# EAGLE design MakePython Audio v2.0 (EAGLE 6.1)
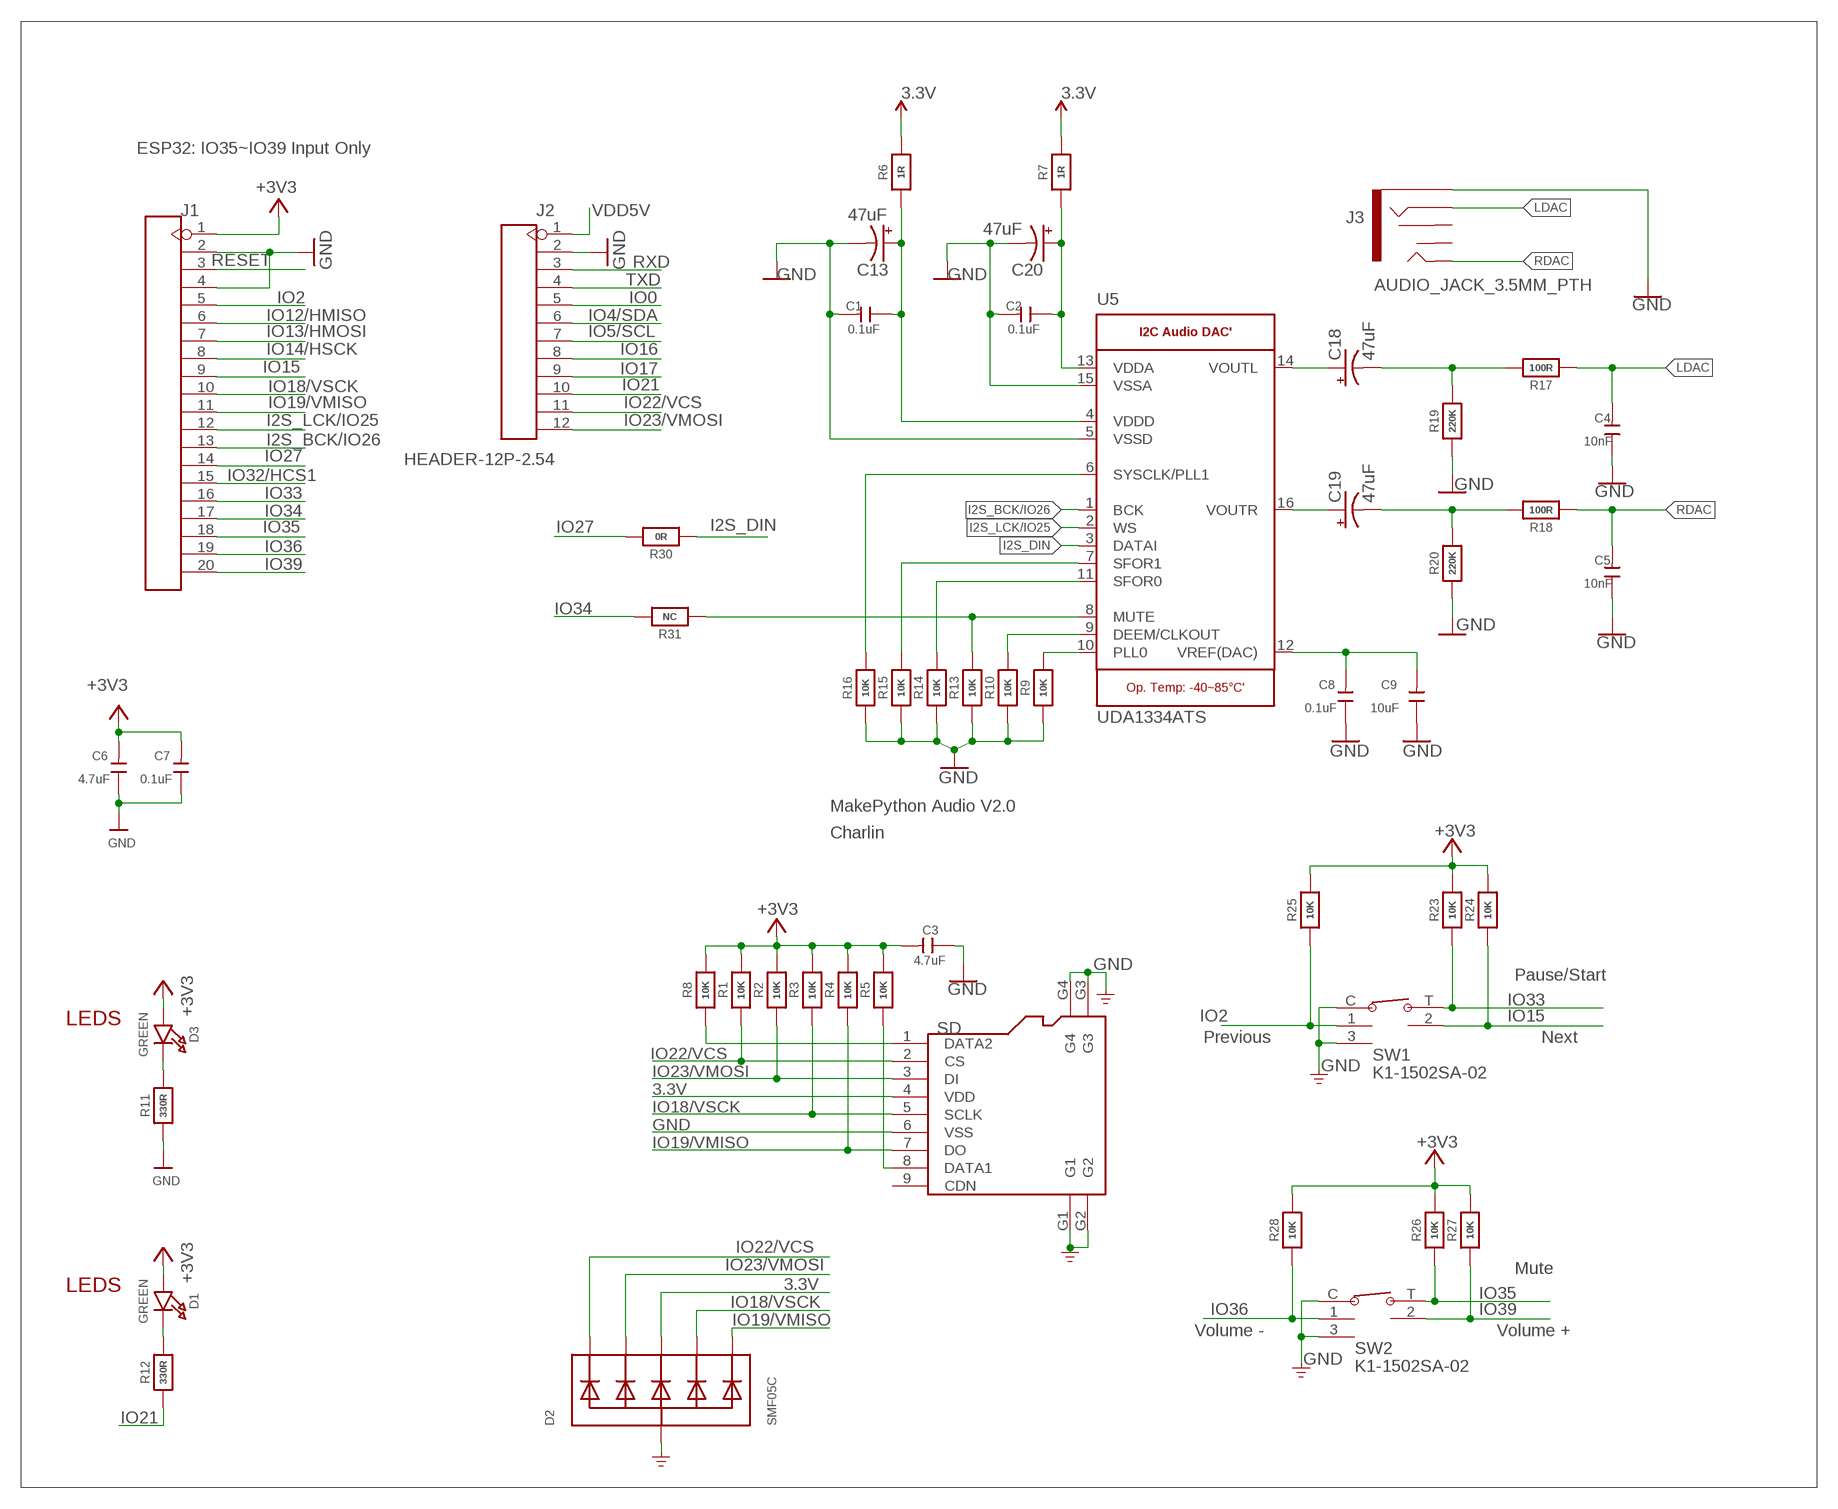
[diagram p0: schematic, sheet 1]

## Parts
C1  0.1uF  DISCRETE_C-0603  [DISCRETE_C0603]
C2  0.1uF  DISCRETE_C-0603  [DISCRETE_C0603]
C3  4.7uF  DISCRETE_C-0603  [DISCRETE_C0603]
C4  10nF  DISCRETE_C-0603  [DISCRETE_C0603]
C5  10nF  DISCRETE_C-0603  [DISCRETE_C0603]
C6  4.7uF  DISCRETE_C-0603  [DISCRETE_C0603]
C7  0.1uF  DISCRETE_C-0603  [DISCRETE_C0603]
C8  0.1uF  DISCRETE_C-0603  [DISCRETE_C0603]
C9  10uF  DISCRETE_C-0603  [DISCRETE_C0603]
C13  47uF  47UF-POLAR-EIA3528-10V-10%  [EIA3528]
C18  47uF  47UF-POLAR-EIA3528-10V-10%  [EIA3528]
C19  47uF  47UF-POLAR-EIA3528-10V-10%  [EIA3528]
C20  47uF  47UF-POLAR-EIA3528-10V-10%  [EIA3528]
D1  GREEN  LED0805_NOOUTLINE  [CHIPLED_0805_NOOUTLINE]
D2  SMF05C  TVSARRAY_5LANE  [SOT363]
D3  GREEN  LED0805_NOOUTLINE  [CHIPLED_0805_NOOUTLINE]
J1  HEADER-20P-2.54  [20P-2.54]
J2  HEADER-12P-2.54  [12P-2.54]
J3  AUDIO_JACK_3.5MM_PTH  [AUDIO-JACK]
R1  10K  RESISTOR_0603_NOOUT  [0603-NO]
R2  10K  RESISTOR_0603_NOOUT  [0603-NO]
R3  10K  RESISTOR_0603_NOOUT  [0603-NO]
R4  10K  RESISTOR_0603_NOOUT  [0603-NO]
R5  10K  RESISTOR_0603_NOOUT  [0603-NO]
R6  1R  RESISTOR_0603_NOOUT  [0603-NO]
R7  1R  RESISTOR_0603_NOOUT  [0603-NO]
R8  10K  RESISTOR_0603_NOOUT  [0603-NO]
R9  10K  RESISTOR_0603_NOOUT  [0603-NO]
R10  10K  RESISTOR_0603_NOOUT  [0603-NO]
R11  330R  RESISTOR_0603_NOOUT  [0603-NO]
R12  330R  RESISTOR_0603_NOOUT  [0603-NO]
R13  10K  RESISTOR_0603_NOOUT  [0603-NO]
R14  10K  RESISTOR_0603_NOOUT  [0603-NO]
R15  10K  RESISTOR_0603_NOOUT  [0603-NO]
R16  10K  RESISTOR_0603_NOOUT  [0603-NO]
R17  100R  RESISTOR_0603_NOOUT  [0603-NO]
R18  100R  RESISTOR_0603_NOOUT  [0603-NO]
R19  220K  RESISTOR_0603_NOOUT  [0603-NO]
R20  220K  RESISTOR_0603_NOOUT  [0603-NO]
R23  10K  RESISTOR_0603_NOOUT  [0603-NO]
R24  10K  RESISTOR_0603_NOOUT  [0603-NO]
R25  10K  RESISTOR_0603_NOOUT  [0603-NO]
R26  10K  RESISTOR_0603_NOOUT  [0603-NO]
R27  10K  RESISTOR_0603_NOOUT  [0603-NO]
R28  10K  RESISTOR_0603_NOOUT  [0603-NO]
R30  0R  RESISTOR_0603_NOOUT  [0603-NO]
R31  NC  RESISTOR_0603_NOOUT  [0603-NO]
SD  HOLDER-MICROSD-9P  [9P-SMD-W/-RING]
SW1  K1-1502SA-02  [SMD5-60P-1180L1170W]
SW2  K1-1502SA-02  [SMD5-60P-1180L1170W]
U5  UDA1334ATS  MICROBUILDER_AUDIO_I2S_UDA1334""  [MICROBUILDER_SSOP16_4.4MM]

## Nets
3.3V: C3.2 C6.2 C7.2 D1.A D2.4(C3) D3.A J1.1 R1.2 R2.2 R3.2 R4.2 R5.2 R6.2 R7.2 R8.2 R23.2 R24.2 R25.2 R26.2 R27.2 R28.2 SD.4(VDD) ; supply symbol labelled +3V3
GND: C1.2 C2.2 C3.1 C4.1 C5.1 C6.1 C7.1 C8.1 C9.1 C13.C(-) C20.C(-) D2.2(A) J1.2 J1.4 J2.2 J3.SLEEVE R9.1 R10.1 R11.1 R13.1 R14.1 R15.1 R16.1 R19.1 R20.1 SD.6(VSS) SD.G1 SD.G2 SD.G3 SD.G4 SW1.3 SW1.C SW2.3 SW2.C U5.5(VSSD) U5.15(VSSA)
I2S_BCK/IO26: J1.13 U5.1(BCK)
I2S_DIN: R30.1 U5.3(DATAI)
I2S_LCK/IO25: J1.12 U5.2(WS)
IO0: J2.5
IO2: J1.5 R25.1 SW1.1
IO4/SDA: J2.6
IO5/SCL: J2.7
IO12/HMISO: J1.6
IO13/HMOSI: J1.7
IO14/HSCK: J1.8
IO15: J1.9 R24.1 SW1.2
IO16: J2.8
IO17: J2.9
IO18/VSCK: D2.5(C4) J1.10 R3.1 SD.5(SCLK)
IO19/VMISO: D2.6(C5) J1.11 R4.1 SD.7(DO)
IO21: J2.10 R12.1
IO22/VCS: D2.1(C1) J2.11 R1.1 SD.2(CS)
IO23/VMOSI: D2.3(C2) J2.12 R2.1 SD.3(DI)
IO27: J1.14 R30.2
IO32/HCS1: J1.15
IO33: J1.16 R23.1 SW1.T
IO34: J1.17 R31.2
IO35: J1.18 R26.1 SW2.T
IO36: J1.19 R28.1 SW2.1
IO39: J1.20 R27.1 SW2.2
LDAC: C4.2 J3.RING R17.1
N$1: R8.1 SD.1(DATA2)
N$2: R5.1 SD.8(DATA1)
N$3: D1.C R12.2
N$5: D3.C R11.2
N$8: C18.A(+) U5.14(VOUTL)
N$11: C19.A(+) U5.16(VOUTR)
N$21: C18.C(-) R17.2 R19.2
N$23: C19.C(-) R18.2 R20.2
N$24: C2.1 C20.A(+) R7.1 U5.13(VDDA)
N$25: C1.1 C13.A(+) R6.1 U5.4(VDDD)
N$26: R16.2 U5.6(SYSCLK/PLL1)
N$27: R15.2 U5.7(SFOR1)
N$28: R14.2 U5.11(SFOR0)
N$29: R13.2 R31.1 U5.8(MUTE)
N$31: R10.2 U5.9(DEEM/CLKOUT)
N$32: R9.2 U5.10(PLL0)
N$33: C8.2 C9.2 U5.12(VREF(DAC))
RDAC: C5.2 J3.TIP R18.1
RESET: J1.3
RXD: J2.3
TXD: J2.4
VDD5V: J2.1
Unconnected: J3.RSH J3.TSH SD.9(CDN)

## Notes on the sheet
- ESP32: IO35~IO39 Input Only
- MakePython Audio V2.0
- Charlin
- Pause/Start
- LEDS
- Previous | Next
- Mute
- LEDS
- Volume - | Volume +

## Library data of the parts
C1-C9 = A9G:DISCRETE_C*: Ceramic Capacitors
C13 C18-C20 = SparkFun-Capacitors:47UF-POLAR: 47µF polarized capacitors A capacitor is a passive two-terminal electrical component used to store electrical energy temporarily in an electric field.; PROD_ID: CAP-08310
D1 D3 = microbuilder:LED: LED 0603 - 0603 Surface Mount Package 2mA: Green LED - Low Power (3.9mcd, 2ma, 1.7Vf) - Digikey: 475-2709-2-ND Orange LED - Low Power (9.8mcd, 2ma, 1.8Vf) - Digikey: 475-1194-2-ND Red LED - Low Power (5mcd, 2ma, 1.8Vf) - Digikey: 475-1195-2-ND Yellow LED - Low Power (7mcd, 2ma, 1.8Vf) - Digikey: 475-1196-2-ND 5mA: Blue LED - Low Power (17mcd, 5ma, 2.9Vf) - Digikey: LNJ937W8CRACT-ND 0805 - 0805 Surface Mount Package 2mA: Red LED (8.8mcd, 2mA, 1.8Vf, Clear) - Low Power [Digikey: 475-2510-1-ND] Green LED (5mcd, 2mA, 1.8Vf, Clear) - Low Power [Digikey: 475-2730-1-ND] Yellow LED (11.3mcd, 2mA, 1.8Vf, Clear) - Low Power [Digikey: 475-2555-1-ND] 20mA: Red LED (104mcd, 20mA, Diffused) - LS R976 [Digikey: 475-1278-6-ND] Red LED (12mcd, 20mA, 2.0Vf, Clear) - APT2012EC [Digikey: 754-1128-1-ND] Green LED (15mcd, 20mA, 2.2Vf, Clear) - APT2012GC [Digikey: 754-1131-1-ND] Orange LED (160mcd, 20mA, 2.1Vf, Clear) - APT2012SECK [Digikey: 754-1130-1-ND] 1206 - 1206 Surface Mount Package Green LED (26mcd, 20mA, Diffused) - LG N971 [Digikey: 475-1407-6-ND] Red LED (15mcd, 20mA, Diffused) - LH N974 [Digikey: 475-1416-6-ND] Cree - Cree High-Power Surface Mount LEDs XPEBWT-L1-0000-00D50 - White 111lm 350mA 2.9Vf 6200K 110° XTEAWT-00-0000-00000LEE3 - White 114lm 350mA 2.85Vf 5000K 115° Everlight - Everlight 45-21 Series Surface Mount LEDs 45-21/QK2C-B2832AC2CB2/2T - Warm White 2000mcd 20mA 3.25Vf 3050K 120° 45-21/LK2C-B38452C4CB2/2T - Nuetral White 2000mcd 20mA 3.25Vf 4150K 120° 45-21/LK2C-B50634C6CB2/2T - Cold White 2200mcd 20mA 3.25Vf 5650K 120° PLCC2 Reverse Mount LS T77K-J1L2-1-0-2-R18-Z - Red 11.25mcd 2mA 1.8Vf 630nm 120° LO T77K-L1M2-24-Z - Orange 19.6mcd 2mA 1.8Vf 606nm 120° LY T77K-K2M1-26-Z - Yellow 15.7mcd 2mA 1.8Vf 587nm 120°
D2 = microbuilder:TVSARRAY_5LANE: Voltage Transient Suppressor Array SOT363 SMF05C - 100W 5V: Digikey - SMF05CT1GOSCT-ND
J1 = Connector:HEADER-20P
J2 = Connector:HEADER-12P
J3 = SparkFun-Connectors:AUDIO_JACK_3.5MM: Audio Jack 3.5mm variants of PTH and SMT stereo audio jack with bypass switches. SparkFun Products: SparkFun SparkPunk Sound Kit <[https://www.sparkfun.com/products/11177]> - PTH MP3 Trigger <https://www.sparkfun.com/products/13720> -3.5mm SMD SparkFun PicoBoard <https://www.sparkfun.com/products/11888>- 2.5mm SMD; PROD_ID: CONN-08774; SF_ID: PRT-08032
R1-R20 R23-R28 R30 R31 = microbuilder:RESISTOR: Resistors For new designs, use the packages preceded by an '_' character since they are more reliable: The following footprints should be used on most boards: _0402 - Standard footprint for regular board layouts _0603 - Standard footprint for regular board layouts _0805 - Standard footprint for regular board layouts _1206 - Standard footprint for regular board layouts For extremely tight-pitch boards where space is at a premium, the following 'micro-pitch' footprints can be used (smaller pads, no silkscreen outline, etc.): _0402MP - Micro-pitch footprint for very dense/compact boards _0603MP - Micro-pitch footprint for very dense/compact boards _0805MP - Micro-pitch footprint for very dense/compact boards _1206MP - Micro-pitch footprint for very dense/compact boards
SD = Connector:HOLDER-MICROSD-9P
SW1 SW2 = self:K1-1502SA-02
U5 = Adafruit UDA1334 I2S DAC:MICROBUILDER_AUDIO_I2S_UDA1334: UDA1334 I2C Audio DAC Power Supply: 2.4-3.6V Sample frequencies from 16-100kHz

## Net classes
0 default: width 0.203 mm, drill 0.305 mm, clearance 0.152 mm
2 gnd: width 0.305 mm, drill 0.559 mm, clearance 0.254 mm
3 usbvcc: width 0.508 mm, drill 0.61 mm, clearance 0.254 mm

## Board
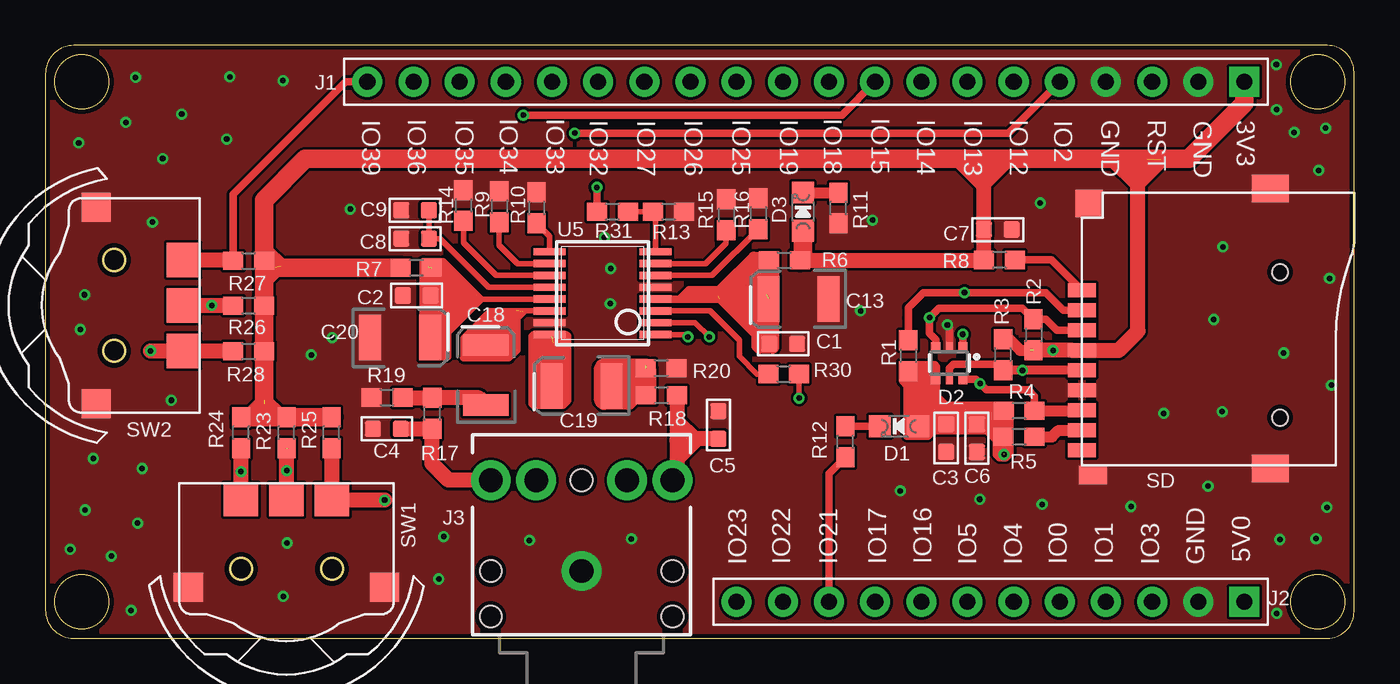
[diagram p1: board, top side]
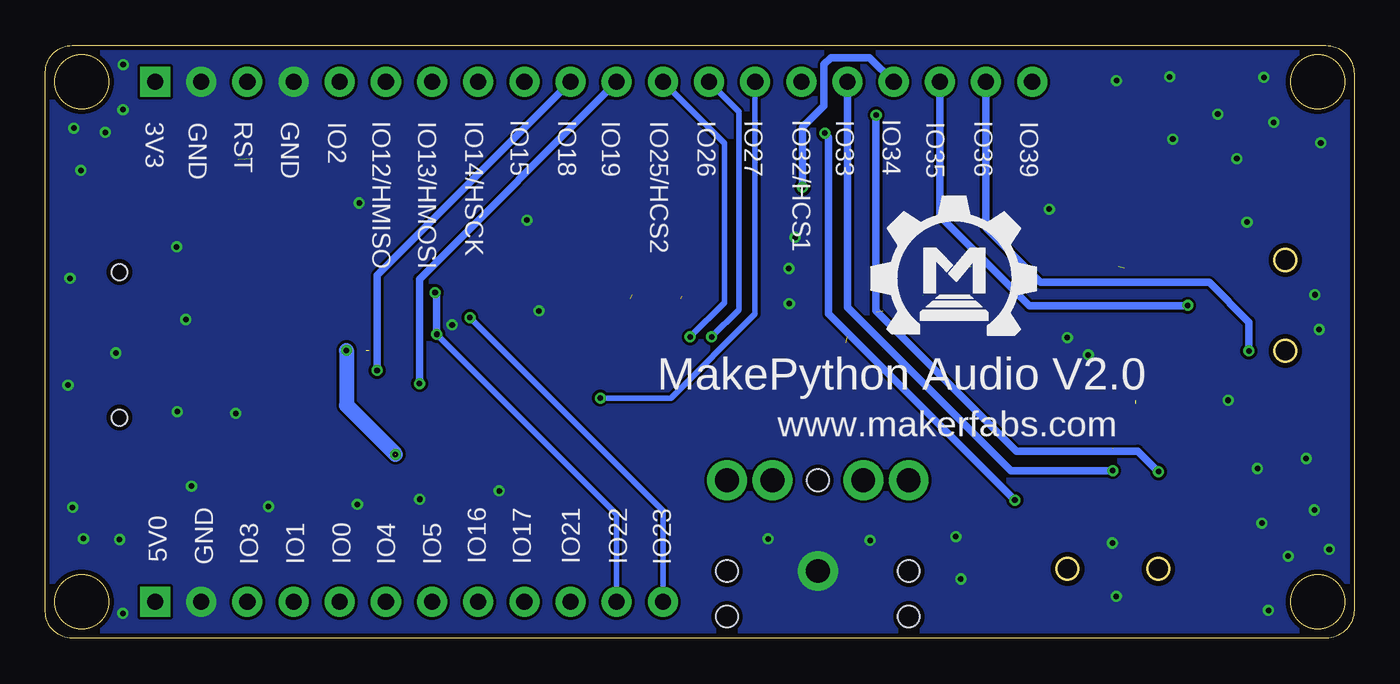
[diagram p2: board, bottom side, seen from below]

Size 72 x 32.6 mm. Coordinates in mm from the lower left corner, seen from the top.
Outline: 1.55,0 70.53,0 arc90 72,1.47 72,31.12 arc90 70.52,32.6 1.55,32.6 arc90 0,31.05 0,1.55 arc90 1.55,0
Outline: circle at 70,2 radius 1.5
Outline: circle at 70,30.6 radius 1.5
Outline: circle at 2,2 radius 1.5
Outline: circle at 2,30.6 radius 1.5
Copper layers (1*16): Top 0.035mm / dielectric 1.5mm / Bottom 0.035mm
Design rules: minimum track width 6mil, minimum drill 12mil, track to track 6mil, track to pad 6mil, pad to pad 6mil, via to via 6mil, smd to smd 0mil, copper to edge 10mil, drill to drill 10mil, minimum pad ring 10mil, minimum via ring 6mil, stop-mask expansion 2mil, vias tented up to drill 100mil, thermal gap 0mil

### Footprints (pad centres in the part's own frame; a part is rotated, then mirrored left to right if it is on the bottom)
DISCRETE_C0603 = smd 0.889 x 0.889: 1 -0.762,0; 2 0.762,0
EIA3528 = smd 1.2 x 2.5: A 1.65,0; C -1.65,0
CHIPLED_0805_NOOUTLINE = smd 1.2 x 1.2: A 0,-1.05; C 0,1.05
SOT363 = smd 0.5 x 0.5: 1 -0.75,-0.9; 3 0.75,-0.9; 4 0.75,0.9; 6 -0.75,0.9 | smd 0.4 x 0.5: 2 0,-0.9; 5 0,0.9
20P-2.54 = drill 0.889 pad 1.651 square: 1 -25.4,0 | drill 0.889 pad 1.651: 2 -22.86,0; 3 -20.32,0; 4 -17.78,0; 5 -15.24,0; 6 -12.7,0; 7 -10.16,0; 8 -7.62,0; 9 -5.08,0; 10 -2.54,0; 11 0,0; 12 2.54,0; 13 5.08,0; 14 7.62,0; 15 10.16,0; 16 12.7,0; 17 15.24,0; 18 17.78,0; 19 20.32,0; 20 22.86,0
12P-2.54 = drill 0.889 pad 1.651 square: 1 0,13.97 | drill 0.889 pad 1.651: 2 0,11.43; 3 0,8.89; 4 0,6.35; 5 0,3.81; 6 0,1.27; 7 0,-1.27; 8 0,-3.81; 9 0,-6.35; 10 0,-8.89; 11 0,-11.43; 12 0,-13.97
AUDIO-JACK = drill 1.3 pad 2.184: RING 5,5; RSH 5,2.5; SLEEVE 0,0; TIP 5,-5; TSH 5,-2.5 | hole 1.2: 0,5; -2.5,5; -2.5,-5; 0,-5; 5,0
0603-NO = smd 1.1 x 1: 1 -0.85,0; 2 0.85,0
9P-SMD-W/-RING = smd 1.524 x 0.762: 1 0,4.4; 2 0,3.3; 3 0,2.2; 4 0,1.1; 5 0,0; 6 0,-1.1; 7 0,-2.2; 8 0,-3.3; 9 0,-4.4 | smd 1.524 x 1.016: G1 0.6,-5.746 | smd 2.032 x 1.524: G2 10.373,-5.4; G3 10.373,10 | smd 1.524 x 1.524: G4 0.392,9.181 | hole 0.889: 10.9,-2.6; 10.9,5.4
SMD5-60P-1180L1170W = smd 1.9 x 1.8: 1 -2.5,0; 2 2.5,0; T 0,0 | smd 1.6 x 1.6: 3 -5.4,4.8; C 5.4,4.8
MICROBUILDER_SSOP16_4.4MM = smd 0.4 x 1.75: 1 -2.275,-2.92; 2 -1.625,-2.92; 3 -0.975,-2.92; 4 -0.325,-2.92; 5 0.325,-2.92; 6 0.975,-2.92; 7 1.625,-2.92; 8 2.275,-2.92; 9 2.275,2.92; 10 1.625,2.92; 11 0.975,2.92; 12 0.325,2.92; 13 -0.325,2.92; 14 -0.975,2.92; 15 -1.625,2.92; 16 -2.275,2.92

### Placement (x,y rotation side)
C1  40.59,16.19 0 top
C2  20.43,18.85 180 top
C3  49.56,11.01 90 top
C4  18.78,11.51 0 top
C5  37.02,11.72 270 top
C6  51.25,11 90 top
C7  52.4,22.47 180 top
C8  20.34,21.98 0 top
C9  20.34,23.54 0 top
C13  41.42,18.64 180 top
C18  24.23,14.48 90 top
C19  29.51,13.87 180 top
C20  19.52,16.53 0 top
D1  46.96,11.65 90 top
D2  49.73,15.13 180 top
D3  41.68,23.46 0 top
J1  40.57,30.6 180 top
J2  52,2 270 top
J3  29.5,3.69 90 top
R1  47.47,15.53 270 top
R2  54.36,16.69 270 top
R3  52.69,15.59 90 top
R4  53.57,12.52 180 top
R5  53.57,11.07 180 top
R6  40.65,20.78 0 top
R7  20.4,20.37 180 top
R8  52.49,20.8 180 top
R9  24.97,23.73 270 top
R10  27.01,23.67 270 top
R11  43.63,23.66 90 top
R12  44.01,10.8 90 top
R13  34.29,23.45 180 top
R14  22.99,23.8 270 top
R15  37.45,23.28 270 top
R16  39.22,23.35 270 top
R17  21.28,12.36 90 top
R18  33.9,13.36 180 top
R19  18.79,13.24 0 top
R20  33.88,14.85 180 top
R23  13.28,11.3 90 top
R24  10.77,11.3 90 top
R25  15.75,11.3 90 top
R26  11.18,18.28 0 top
R27  11.18,20.75 0 top
R28  11.18,15.77 0 top
R30  40.62,14.53 0 top
R31  31.19,23.46 180 top
SD  57.03,14.73 0 top
SW1  13.27,7.61 180 top
SW2  7.58,18.3 90 top
U5  30.65,18.98 90 top
U$1  [MAKERFABS_0.3]  26.12,16.71 0 bottom

### Tracks (layer width: path | path; a pad name or v marks a point on that pad's centre or on a via)
3.3V  (via drill 0.3)  (5 unrouted)
  Top 0.305: R4.2 52.72,10.12 v52.74,10.1 | 54.11,15.84 54.1,15.83
  Top 0.406: R1.2 47.92,14.23 | 47.92,14.23 D2.4 | R5.2 52.72,11.67 | 52.72,11.67 R4.2 | 52.72,11.67 51.34,11.67 C6.2 C3.2 48.13,11.77 D1.A 48.01,14.14 47.92,14.23 | R8.2 | 51.61,26.14 51.39,26.36 | R3.2 52.76,16.44 | 56.52,15.83 | 47.18,15 47.21,15.03 48.93,15.03 49.03,14.93 49.03,13.34 49.56,12.82 52.82,12.82 53.07,12.57 53.07,10.14 52.85,9.93 52.49,9.93 52.33,10.1 52.33,10.89 51.81,11.41 48.86,11.41 48.56,11.11 47.41,11.11 47.41,13.89 47.17,14.13 47.17,14.56 47.35,14.74 48.74,14.74 48.78,14.7 48.78,13.12 49.45,12.45 52.13,12.45 52.39,12.19 52.39,10.49 52.75,10.12 52.75,10.92 52.11,11.56 52.11,12.05 52.06,12.09 | R2.2 v55.44,15.83 v55.44,15.84
  Top 0.61: SD.4 56.52,15.83 | 52.76,16.44 53.03,16.44 53.64,15.83 R2.2 | 54.18,15.83 54.11,15.83 54.1,15.83
  Top 0.813: 56.52,15.83 54.18,15.83 | R6.2 51.61,20.78 R8.2 | R8.2 C7.2 51.61,22.5 51.61,25.73 | 51.61,26.14 51.61,25.73 | 51.63,25.01 52.95,26.33 53.15,26.33 53.14,26.34 50.21,26.34 51.55,24.99 51.61,24.99 51.61,25.73 | 12.02,13.55 12.02,13.1 12.87,12.25 | 14.1,20.45 12.96,20.45 12.11,21.29 | 56.52,15.83 59.06,15.83 60.12,16.89 60.12,25.89 60.59,26.36 | 58.79,26.4 58.79,26.27 60.07,24.99 | 60.07,24.99 | 60.07,24.99 61.39,26.32 | 52.06,12.09 48.97,12.09 48.61,11.74 48.61,12.36 48.91,12.66 48.01,12.66 47.8,12.44 47.8,14.28 47.67,14.41 48.24,14.41 48.3,14.35 48.3,13.07 48.36,13.01
  Top 1.016: J1.1 65.96,29.43 62.9,26.36 60.59,26.36 51.39,26.36 14.3,26.36 12.03,24.09 R27.2 12.03,19.76 | R25.2 R23.2 11.29,12.15 | 11.29,12.15 R24.2 | 11.29,12.15 12.03,12.89 R28.2 R26.2 12.03,19.76 | R7.2 12.64,20.38 12.03,19.76 | D3.A 41.68,20.96 R6.2
  Bottom 0.813: v55.44,15.84 55.44,12.8 v52.74,10.1
GND  (via drill 0.3)
  Top 0.406: D2.2 49.73,17.13 v49.62,17.23
  other vias: 70.5,7.2 69.91,5.47 67.74,1.36 67.92,5.43 70.76,13.92 70.65,19.79 68.12,15.69 68.71,27.82 70.44,28.05 67.73,29.07 67.72,31.55 70.05,25.73 64.78,21.52 45.51,22.99 44.85,18 61.53,12.37 54.73,23.93 51.4,7.64 47.04,8.11 32.24,5.46 26.63,5.38 21.91,5.58 13.09,2.3 13.29,5.24 5.07,6.33 2.18,7.05 4.72,1.53 3.62,4.51 1.36,4.89 5.31,9.33 2.63,9.88 6.93,13.09 4.42,28.37 9.97,27.45 10.14,30.87 4.96,30.85 7.5,28.82 1.83,27.24 2.16,18.89 1.92,16.98 5.89,22.88 16.77,23.6 14.62,15.58 15.78,16.53 31.1,20.33 31.08,18.4 30.75,22.04 64.27,17.53 64.75,12.46 59.72,7.24 54.84,7.36 63.97,8.36 21.64,3.25 6.45,26.37 13.07,30.67
  pour Bottom: -7.62,34.29 76.2,34.29 76.2,-5.08 -7.62,-5.08
  pour Top: -7.62,34.29 76.2,34.29 76.2,-5.08 -7.62,-5.08
I2S_BCK/IO26  (via drill 0.3)
  Top 0.305: v35.35,16.57 35.22,16.7 U5.1
  Bottom 0.305: J1.13 33.85,28.96 33.85,18.07 v35.35,16.57
I2S_DIN
  Top 0.305: U5.3 36.58,18 38.19,16.39 38.19,15.5 39.16,14.53 R30.1
I2S_LCK/IO25  (via drill 0.3)
  Top 0.305: U5.2 35.75,17.35 v36.53,16.57
  Bottom 0.305: v36.53,16.57 34.64,18.46 34.64,27.22 38.02,30.6 J1.12
IO2  (via drill 0.3)
  Top 0.406: J1.5 52.98,27.77 v29.12,27.77 | 15.78,7.6 SW1.1
  Top 0.813: SW1.1 15.77,10.44 R25.1 | v18.66,7.6 15.78,7.6
  Bottom 0.406: v18.66,7.6 28.91,17.84 28.91,27.56 v29.12,27.77
IO15  (via drill 0.3)
  Top 0.406: J1.9 43.82,28.77 v26.29,28.77
  Top 0.813: SW1.2 v10.77,9.16 R24.1
  Bottom 0.406: v26.29,28.77 26.29,18.01 18.57,10.29 11.9,10.29 v10.77,9.16
IO18/VSCK  (via drill 0.3)
  Top 0.406: 52.7,14.73 R3.1 | D2.5 49.73,14.84 49.95,15.05 52.38,15.05 R3.1 | v53.75,14.73 53.74,14.74 R3.1
  Top 0.508: SD.5 v53.75,14.73 52.7,14.73
  Bottom 0.406: J1.10 53.75,19.96 v53.75,14.73
IO19/VMISO  (via drill 0.3)
  Top 0.406: D2.6 51.19,14.23 v51.42,14 51.76,13.66 51.91,13.66 54.08,13.66 54.42,13.32 R4.1
  Top 0.61: R4.1 57.01,12.52 SD.7
  Bottom 0.406: J1.11 51.42,19.75 v51.42,14
IO21
  Top 0.406: J2.10 43.11,9.05 R12.1
IO22/VCS  (via drill 0.3)
  Top 0.406: SD.2 56,18.03 55.03,19 v50.56,19 48.3,19 47.48,18.18 47.48,17.62 47.48,16.39 R1.1 | D2.1 v50.48,16.71 v50.48,16.72
  Bottom 0.305: J2.11 40.57,6.81 v50.48,16.72
  Bottom 0.406: v50.48,16.72 50.48,18.91 v50.56,19
IO23/VMOSI  (via drill 0.3)
  Top 0.406: D2.3 48.98,16.42 48.64,16.76 v48.64,17.63 49.15,18.14 53.75,18.14 R2.1 55.05,17.54 55.66,16.93 SD.3
  Bottom 0.305: v48.64,17.63 38.03,7.02 J2.12
IO27  (via drill 0.3)
  Top 0.305: v41.47,13.2 R30.2
  Bottom 0.305: J1.14 32.95,17.83 37.59,13.2 v41.46,13.2 v41.47,13.2
IO33  (via drill 0.3)  (1 unrouted)
  Top 0.406: v13.28,9.21 13.29,9.22 13.29,10.43
  Top 0.813: SW1.T 13.27,10.44 R23.1
  Bottom 0.406: J1.16 27.87,18.19 18.89,9.21 v13.28,9.21
IO34  (via drill 0.3)
  Top 0.406: v30.34,24.8 R31.2
  Bottom 0.406: J1.17 26.65,31.92 28.79,31.92 29.16,31.55 29.16,29.28 30.34,28.1 v30.34,24.8
IO35  (via drill 0.3)
  Top 0.813: SW2.T v9.15,18.3 10.3,18.3 R26.1
  Bottom 0.406: J1.18 22.79,23.21 17.86,18.28 9.18,18.28 v9.15,18.3
IO36  (via drill 0.3)
  Top 0.406: v5.79,15.8
  Top 0.813: R28.1 10.3,15.8 SW2.1 v5.79,15.8
  Bottom 0.406: J1.19 20.25,22.57 17.25,19.57 7.97,19.57 5.79,17.39 v5.79,15.8
IO39
  Top 0.406: J1.20 16.51,30.6 10.33,24.41 R27.1
  Top 0.813: SW2.2 10.28,20.8 R27.1
LDAC
  Top 0.813: C4.2 R17.1 21.27,11.49 21.27,9.6 22.18,8.69 J3.RING
N$1
  Top 0.406: SD.1 55.35,20.8 R8.1
N$2
  Top 0.61: R5.1 55.38,11.07 55.74,11.43 SD.8
N$3
  Top 0.406: R12.2 D1.C
N$5
  Top 0.406: R11.2
  Top 0.61: D3.C R11.2
N$8  (2 unrouted)
  Top 0.305: U5.14 25.92,18 24.23,16.32 C18.A
  Top 0.406: 25.19,16.3 23.55,16.3 23.19,16.67 24.46,17.95 26.27,17.95 25.94,17.62 25.94,15.87 23.05,15.87 23.02,15.9 23.02,16.5 23.38,16.86 23.81,16.86 24.65,17.7 25.51,17.7 25.62,17.59 25.62,16.16 25.68,16.1 25.68,16.49 25.24,16.93 24.35,16.93 24.34,16.91 24.34,17.07 24.73,17.46 25.03,17.46 25.42,17.07 24.93,17.07 24.8,17.2 | 24.49,16.97 24.29,16.97 23.51,16.18 23.12,16.18 23.02,16.08 23.02,15.42 23.02,15.41 25.49,15.41 25.94,15.87 25.63,15.87 25.24,15.48
N$11  (1 unrouted)
  Top 0.305: C19.A 27.86,16.57 U5.16
  Top 0.406: 28.21,13.17 27.89,13.17 27.54,12.82 26.86,12.82 26.79,12.9 26.79,16.62 26.87,16.7 28.65,16.7 28.72,16.63 28.72,13.07 28.47,12.82 27.33,12.82 27.11,13.04 27.11,16.34 27.08,16.37 28.4,16.37 28.43,16.35 28.43,13.01 28.41,12.99 28.41,14.72 28.08,15.05 28.08,16.14 27.97,16.25 27.6,16.25 27.42,16.06 27.42,14.97 27.33,14.88 27.48,14.88 27.62,15.02 27.62,16.1 27.59,16.13
N$21
  Top 0.813: R19.2 19.68,13.21 R17.2 23.85,13.21 C18.C
N$23  (1 unrouted)
  Top 0.813: R18.2 33.05,13.85 | 33.05,13.85 33.05,14.83 R20.2 | C19.C 33.03,13.87 33.05,13.85 | 31.15,14.67 31.43,14.95 32.86,14.95 32.86,13.74 32.09,12.97 30.71,12.97 30.6,13.09 30.6,14.87 30.7,14.97 33.02,14.97 33.18,14.81 33.18,13.75 33.17,13.74 32.96,13.74 32.28,14.43 31.9,14.43 31.9,13.49 31.92,13.47
N$24  (2 unrouted)
  Top 0.305: U5.13 21.39,18.65 C2.1 | C20.A 21.17,18.83 C2.1 | C2.1 21.19,20.31 R7.1
  Top 0.406: 21.12,15.57 20.78,15.57 20.78,20.7 21.88,20.7 23.72,18.87 | 23.72,18.87 23.72,18.42 22.12,16.82 22.12,15.49 22.11,15.48 21.51,15.48 21.68,15.65 21.8,15.65 21.84,15.69 21.84,17.18 22.07,17.18 23.46,18.57 23.46,18.83 22.11,17.49 21.82,17.49 21.46,17.86 21.01,17.86 21.07,17.91 21.07,20.45 21.08,20.44 21.7,20.44 23.2,18.94 23.2,18.86 22.2,17.86 21.61,17.86 21.45,18.02 21.45,19.83 21.54,19.91 21.8,19.91 22.75,18.97 22.75,18.73 22.22,18.2 21.76,18.2 21.81,18.25 21.81,19.61 22.4,19.02 22.4,18.68 22.19,18.46 22.1,18.46 22.1,18.47 22.1,18.99 | 23.09,19.17 23.39,18.87 23.72,18.87 | 23.72,18.87 23.94,18.65 23.94,18.64 21.94,16.64 21.91,16.64
N$25  (2 unrouted)
  Top 0.305: C13.A | R6.1 39.8,18.67 C13.A | C13.A 39.77,16.24 C1.1
  Top 0.406: U5.4 C13.A | 37.35,19.34 37.3,19.39 37.26,19.39 37.04,19.16 35.42,19.16 34.97,18.71 34.96,18.71 35.06,18.81 37,18.81 | 38.3,17.97 37.74,17.97 37.05,18.66
  Top 0.61: 39.69,18.89 39.69,18.88 40.07,18.5 40.07,15.99 40.02,15.94 39.27,15.94 39.14,16.07 39.14,16.72 37.35,18.5 37.35,19.34 38.97,20.96 40.03,20.96 40.04,20.95 40.04,16.85 39.76,16.57 39.56,16.57 39.44,16.69 39.44,20.33 39.26,20.51 39.2,20.51 37.73,19.05 37.73,18.56 39.06,17.23 39.06,19.65 38.84,19.88 38.84,18.29 38.56,18.01 38.56,18.98 38.28,19.26 38.28,18.68 38.15,18.55 38.14,18.55 37.35,19.34
N$26
  Top 0.305: U5.6 36.67,19.95 R16.2
N$27
  Top 0.305: U5.7 36.33,20.6 37.45,21.73 R15.2
N$28
  Top 0.305: U5.11 24.8,19.95 23,21.74 23,22.94 R14.2
N$29
  Top 0.305: U5.8 33.57,23.32 R13.2 R31.1
N$31
  Top 0.305: U5.9 27.73,22.1 R10.2
N$32
  Top 0.305: U5.10 25.97,20.6 24.97,21.6 R9.2
N$33
  Top 0.305: U5.12 24.38,19.3 21.71,21.98 C8.2 | C8.2 | C8.2 C9.2
RDAC
  Top 0.813: R18.1 34.75,10.91 | 34.75,10.91 34.75,8.94 J3.TIP | C5.2 35.15,10.96 | 35.15,10.96 34.8,10.96 34.75,10.91 | 34.76,11.97 34.76,11.94 35.72,10.98 | 35.72,10.98 35.72,10.83 34.85,9.97 | 35.72,10.98 35.18,10.98 35.15,10.96

### Text on the board
tPlace: IO39 | IO36 | IO35 | IO34 | IO33 | IO32 | IO26 | IO25 | IO19 | IO18 | IO15 | IO14 | IO13 | IO12 | GND | RST | IO27 | IO2 | GND | 3V3 | IO23 | IO22 | IO21 | IO17 | IO16 | IO5 | IO4 | IO0 | IO1 | IO3 | GND | 5V0
bPlace: IO34 | IO33 | IO32/HCS1 | IO18 | IO15 | IO39 | IO36 | IO35 | IO27 | IO26 | IO25/HCS2 | IO19 | IO14/HSCK | IO13/HMOSI | IO12/HMISO | IO2 | GND | RST | GND | 3V3 | MakePython Audio V2.0 | www.makerfabs.com | IO23 | IO22 | IO21 | IO17 | IO16 | IO5 | IO4 | IO0 | IO1 | IO3 | GND | 5V0